# Altium schematic sheet SCH-2-Main Controls.SchDoc
size Letter
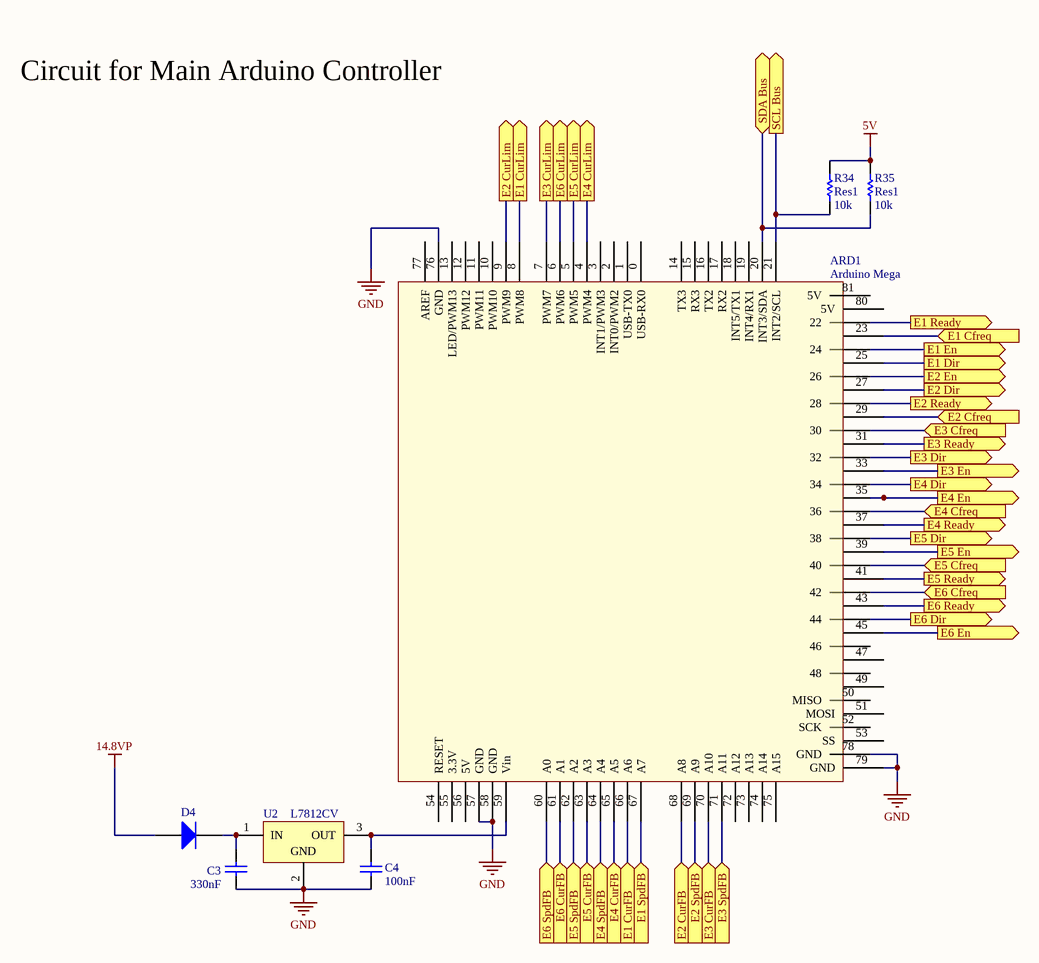
[diagram p0: SCH-2-Main Controls.SchDoc]

## Parts
ARD1  Arduino Mega  [Arduino Mega]
C3  value 330nF  [1608[0603]]  (hidden comment: Cap)
C4  value 100nF  [1608[0603]]  (hidden comment: Cap)
D4  Diode 1N4001  [DO-41]  (value not drawn)
R34  Res1  value 10k  [RESC1608X06N_0603]
R35  Res1  value 10k  [RESC1608X06N_0603]
U2  L7812CV  [TO220]

## Ports
E1 Cfreq (in), E1 CurFB (in), E1 CurLim (out), E1 Dir (out), E1 En (out), E1 Ready (out), E1 SpdFB (in), E2 Cfreq (in), E2 CurFB (in), E2 CurLim (out), E2 Dir (out), E2 En (out), E2 Ready (out), E2 SpdFB (in), E3 Cfreq (in), E3 CurFB (in), E3 CurLim (out), E3 Dir (out), E3 En (out), E3 Ready (out), E3 SpdFB (in), E4 Cfreq (in), E4 CurFB (in), E4 CurLim (out), E4 Dir (out), E4 En (out), E4 Ready (out), E4 SpdFB (in), E5 Cfreq (in), E5 CurFB (in), E5 CurLim (out), E5 Dir (out), E5 En (out), E5 Ready (out), E5 SpdFB (in), E6 Cfreq (in), E6 CurFB (in), E6 CurLim (out), E6 Dir (out), E6 En (out), E6 Ready (out), E6 SpdFB (in), SCL Bus (out), SDA Bus (bidir)

## Nets
5V: R34.2 R35.2
14.8VP: D4.1(A)
GND: ARD1.57(GND) ARD1.58(GND) ARD1.76(GND) ARD1.78(GND) ARD1.79(GND) C3.2 C4.2 U2.2(GND)
E1 Cfreq: ARD1.23 ; port E1 Cfreq
E1 CurFB: ARD1.66(A6) ; port E1 CurFB
E1 CurLim: ARD1.8(PWM8) ; port E1 CurLim
E1 Dir: ARD1.25 ; port E1 Dir
E1 En: ARD1.24 ; port E1 En
E1 Ready: ARD1.22 ; port E1 Ready
E1 SpdFB: ARD1.67(A7) ; port E1 SpdFB
E2 Cfreq: ARD1.29 ; port E2 Cfreq
E2 CurFB: ARD1.68(A8) ; port E2 CurFB
E2 CurLim: ARD1.9(PWM9) ; port E2 CurLim
E2 Dir: ARD1.27 ; port E2 Dir
E2 En: ARD1.26 ; port E2 En
E2 Ready: ARD1.28 ; port E2 Ready
E2 SpdFB: ARD1.69(A9) ; port E2 SpdFB
E3 Cfreq: ARD1.30 ; port E3 Cfreq
E3 CurFB: ARD1.70(A10) ; port E3 CurFB
E3 CurLim: ARD1.7(PWM7) ; port E3 CurLim
E3 Dir: ARD1.32 ; port E3 Dir
E3 En: ARD1.33 ; port E3 En
E3 Ready: ARD1.31 ; port E3 Ready
E3 SpdFB: ARD1.71(A11) ; port E3 SpdFB
E4 Cfreq: ARD1.36 ; port E4 Cfreq
E4 CurFB: ARD1.65(A5) ; port E4 CurFB
E4 CurLim: ARD1.4(PWM4) ; port E4 CurLim
E4 Dir: ARD1.34 ; port E4 Dir
E4 En: ARD1.35 ; port E4 En
E4 Ready: ARD1.37 ; port E4 Ready
E4 SpdFB: ARD1.64(A4) ; port E4 SpdFB
E5 Cfreq: ARD1.40 ; port E5 Cfreq
E5 CurFB: ARD1.63(A3) ; port E5 CurFB
E5 CurLim: ARD1.5(PWM5) ; port E5 CurLim
E5 Dir: ARD1.38 ; port E5 Dir
E5 En: ARD1.39 ; port E5 En
E5 Ready: ARD1.41 ; port E5 Ready
E5 SpdFB: ARD1.62(A2) ; port E5 SpdFB
E6 Cfreq: ARD1.42 ; port E6 Cfreq
E6 CurFB: ARD1.61(A1) ; port E6 CurFB
E6 CurLim: ARD1.6(PWM6) ; port E6 CurLim
E6 Dir: ARD1.44 ; port E6 Dir
E6 En: ARD1.45 ; port E6 En
E6 Ready: ARD1.43 ; port E6 Ready
E6 SpdFB: ARD1.60(A0) ; port E6 SpdFB
SCL Bus: ARD1.21(INT2/SCL) R34.1 ; port SCL Bus
SDA Bus: ARD1.20(INT3/SDA) R35.1 ; port SDA Bus
NetARD1_59: ARD1.59(Vin) C4.1 U2.3(OUT)
NetC3_1: C3.1 D4.2(K) U2.1(IN)

Not connected (* = marked no-connect by the designer): ARD1 0(USB-RX0) 1(USB-TX0) 2(INT0/PWM2) 3(INT1/PWM3) 10(PWM10) 11(PWM11) 12(PWM12) 13(LED/PWM13) 14(TX3) 15(RX3) 16(TX2) 17(RX2) 18(INT5/TX1) 19(INT4/RX1) 46 47 48 49 50(MISO) 51(MOSI) 52(SCK) 53(SS) 54(RESET) 55(3.3V) 56(5V) 72(A12) 73(A13) 74(A14) 75(A15) 77(AREF) 80(5V) 81(5V)

## Notes on the sheet
- Circuit for Main Arduino Controller

## Library data of the parts
C3 C4 = Cap: Capacitor; Published: 8-Jun-2000; LatestRevisionDate: 17-Jul-2002; LatestRevisionNote: Re-released for DXP Platform.; PackageReference: RAD-0.3; Publisher: Altium Limited; PackageDescription: Radial Cap, Thru-Hole; 2 Leads; 0.3 in Pin Spacing
D4 = Diode 1N4001: 1 Amp General Purpose Rectifier; Published: 8-Jun-2000; LatestRevisionDate: 17-Jul-2002; LatestRevisionNote: Re-released for DXP Platform.; DatasheetVersion: 1998; PackageVersion: Aug-1999; PackageReference: DO-41; Publisher: Altium Limited; PackageDescription: Diode, Axial; Body 5.2 x 2.7 mm (LxDia. max), Lead Dia. 0.86 mm (max); Code_JEDEC: DO-204-AL; ComponentLink1Description: Manufacturer Link; ComponentLink1URL: http://www.fairchildsemi.com/; ComponentLink2Description: Datasheet; ComponentLink2URL: http://www.fairchildsemi.com/ds/1N%2F1N4001.pdf
R34 R35 = Res1: Resistor; Published: 8-Jun-2000; LatestRevisionDate: 17-Jul-2002; LatestRevisionNote: Re-released for DXP Platform.; PackageReference: AXIAL-0.3; Publisher: Altium Limited; PackageDescription: Axial Device, Thru-Hole; 2 Leads; 0.3 in Pin Spacing
U2 = CMP-0244-00450-1: Positive Voltage Regulator, 12V, 3-Pin TO-220; PackageDescription: TO, Thru-Hole, Vertical, Heatsink Mounted; 3 In-Line Leads; Pitch 2.54 mm; ComponentLink3URL: http://www.st.com/internet/com/TECHNICAL_RESOURCES/TECHNICAL_LITERATURE/PACKAGE_INFORMATION/CD00004649.pdf; ComponentLink1URL: http://www.st.com; ComponentLink2Description: Datasheet; ComponentLink3Description: Package Specification; ComponentLink2URL: http://www.st.com/internet/com/TECHNICAL_RESOURCES/TECHNICAL_LITERATURE/DATASHEET/CD00000444.pdf; DatasheetVersion: 16/11/2011; PackageVersion: ver3.0; PackageReference: TO220; ComponentLink1Description: Manufacturer URL